# Altium project PDBueno.PrjPcb
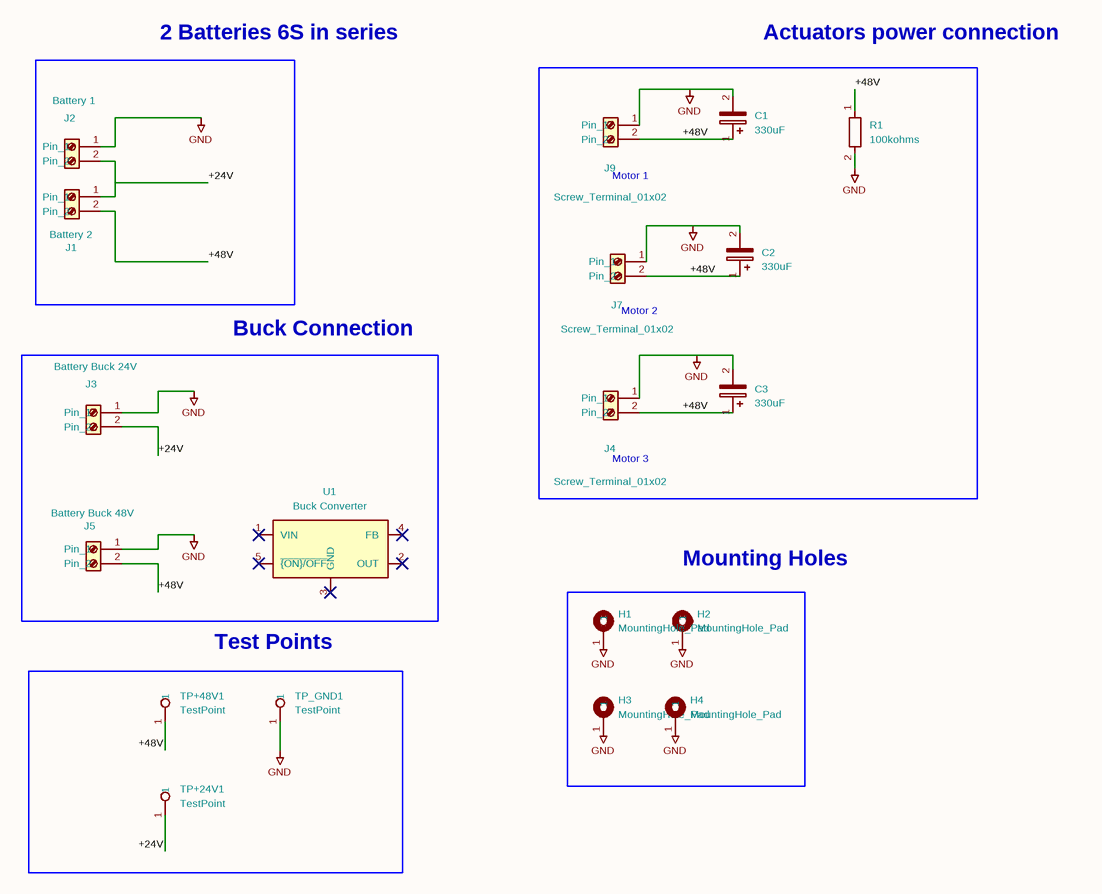
[diagram p0: PDBueno.SchDoc]
1 sheet, 19 parts. Net scope: global (net labels, ports and power ports of the same name join across sheets).
Board files: PDBueno.PcbDoc, PDBueno(1).PcbDoc

## Sheet PDBueno.SchDoc
size 297 x 209 mm

### Parts
C1  330uF  [VZH331M2ATR-1816]
C2  330uF  [VZH331M2ATR-1816]
C3  330uF  [VZH331M2ATR-1816]
H1  MountingHole_Pad  [MountingHole_3.2mm_M3_Pad_Via]
H2  MountingHole_Pad  [MountingHole_3.2mm_M3_Pad_Via]
H3  MountingHole_Pad  [MountingHole_3.2mm_M3_Pad_Via]
H4  MountingHole_Pad  [MountingHole_3.2mm_M3_Pad_Via]
J1  Battery 2  [AMASS_XT90PW-M_1x02_P10.90mm_Horizontal]
J2  Battery 1  [AMASS_XT90PW-M_1x02_P10.90mm_Horizontal]
J3  Battery Buck 24V  [TerminalBlock_bornier-2_P5.08mm]
J4  Screw_Terminal_01x02  [AMASS_XT30PW-M_1x02_P2.50mm_Horizontal]
J5  Battery Buck 48V  [TerminalBlock_bornier-2_P5.08mm]
J7  Screw_Terminal_01x02  [AMASS_XT30PW-M_1x02_P2.50mm_Horizontal]
J9  Screw_Terminal_01x02  [AMASS_XT30PW-M_1x02_P2.50mm_Horizontal]
R1  100kohms  [R_2512_6332Metric_Pad1.40x3.35mm_HandSolder]
TP+24V1  TestPoint  [TestPoint_Pad_D4.0mm]
TP+48V1  TestPoint  [TestPoint_Pad_D4.0mm]
TP_GND1  TestPoint  [TestPoint_Pad_D4.0mm]
U1  Buck Converter  [BEC_Matek_12S_Pro]

### Blocks framed on the sheet
2 Batteries 6S in series /: J1 J2
Buck Connection: J3 J5 U1
Mounting Holes: H1-H4
Test Points: TP+24V1 TP+48V1 TP_GND1

### Nets
GND: C1.2 C2.2 C3.2 H1.1 H2.1 H3.1 H4.1 J2.1(Pin_1) J3.1(Pin_1) J4.1(Pin_1) J5.1(Pin_1) J7.1(Pin_1) J9.1(Pin_1) R1.2 TP_GND1.1
+24V: J1.1(Pin_1) J2.2(Pin_2) J3.2(Pin_2) TP+24V1.1
+48V: C1.1 C2.1 C3.1 J1.2(Pin_2) J4.2(Pin_2) J5.2(Pin_2) J7.2(Pin_2) J9.2(Pin_2) R1.1 TP+48V1.1

Not connected (* = marked no-connect by the designer): U1 1(VIN)* 2(OUT)* 3(GND)* 4(FB)* 5(~{{ON}/OFF})*

### Notes on the sheet
- Actuators power connection
- (near J9) Motor 1
- (near J7) Motor 2
- (near J4) Motor 3
- 1
- 2
- 3
- 4
- 5
- 6
- A
- B
- C
- D
- Title: PDBueno
- File: PDBueno.kicad_sch
- Sheet: /
- AI-Team
- KiCad E.D.A.  kicad (5.1.4)-1
- Size: A4
- Date: 2026-03-14
- Rev:
- Id: 1/1

### Library data of the parts
C1-C3 = C_Polarized: Description: Polarized capacitor; Value: 330uF; Footprint: Footprint_PB_Byte:VZH331M2ATR-1816
H1-H4 = MountingHole_Pad: Description: Mounting Hole with connection; Value: MountingHole_Pad; Footprint: MountingHole:MountingHole_3.2mm_M3_Pad_Via
J1-J5 J7 J9 = Screw_Terminal_01x02: Description: Generic screw terminal, single row, 01x02, script generated (kicad-library-utils/schlib/autogen/connector/)
  J1: Value: Battery 2; Footprint: Connector_AMASS:AMASS_XT90PW-M_1x02_P10.90mm_Horizontal
  J2: Value: Battery 1; Footprint: Connector_AMASS:AMASS_XT90PW-M_1x02_P10.90mm_Horizontal
  J3: Value: Battery Buck 24V; Footprint: TerminalBlock:TerminalBlock_bornier-2_P5.08mm
  J4 J7 J9: Value: Screw_Terminal_01x02; Footprint: Connector_AMASS:AMASS_XT30PW-M_1x02_P2.50mm_Horizontal
  J5: Value: Battery Buck 48V; Footprint: TerminalBlock:TerminalBlock_bornier-2_P5.08mm
R1 = R: Description: Resistor; LCSC: C25717; Value: 100kohms; Footprint: Resistor_SMD:R_2512_6332Metric_Pad1.40x3.35mm_HandSolder
U1 = LM2596S-3.3: Value: Buck Converter; Footprint: Library_mis componentes:BEC_Matek_12S_Pro
TP+24V1 TP+48V1 TP_GND1 = TestPoint: Description: test point; Value: TestPoint; Footprint: TestPoint:TestPoint_Pad_D4.0mm